# Altium schematic sheet BMS.SchDoc: BMS with Temprature monitor
size A4; SheetNumber: 1; SheetTotal: 1
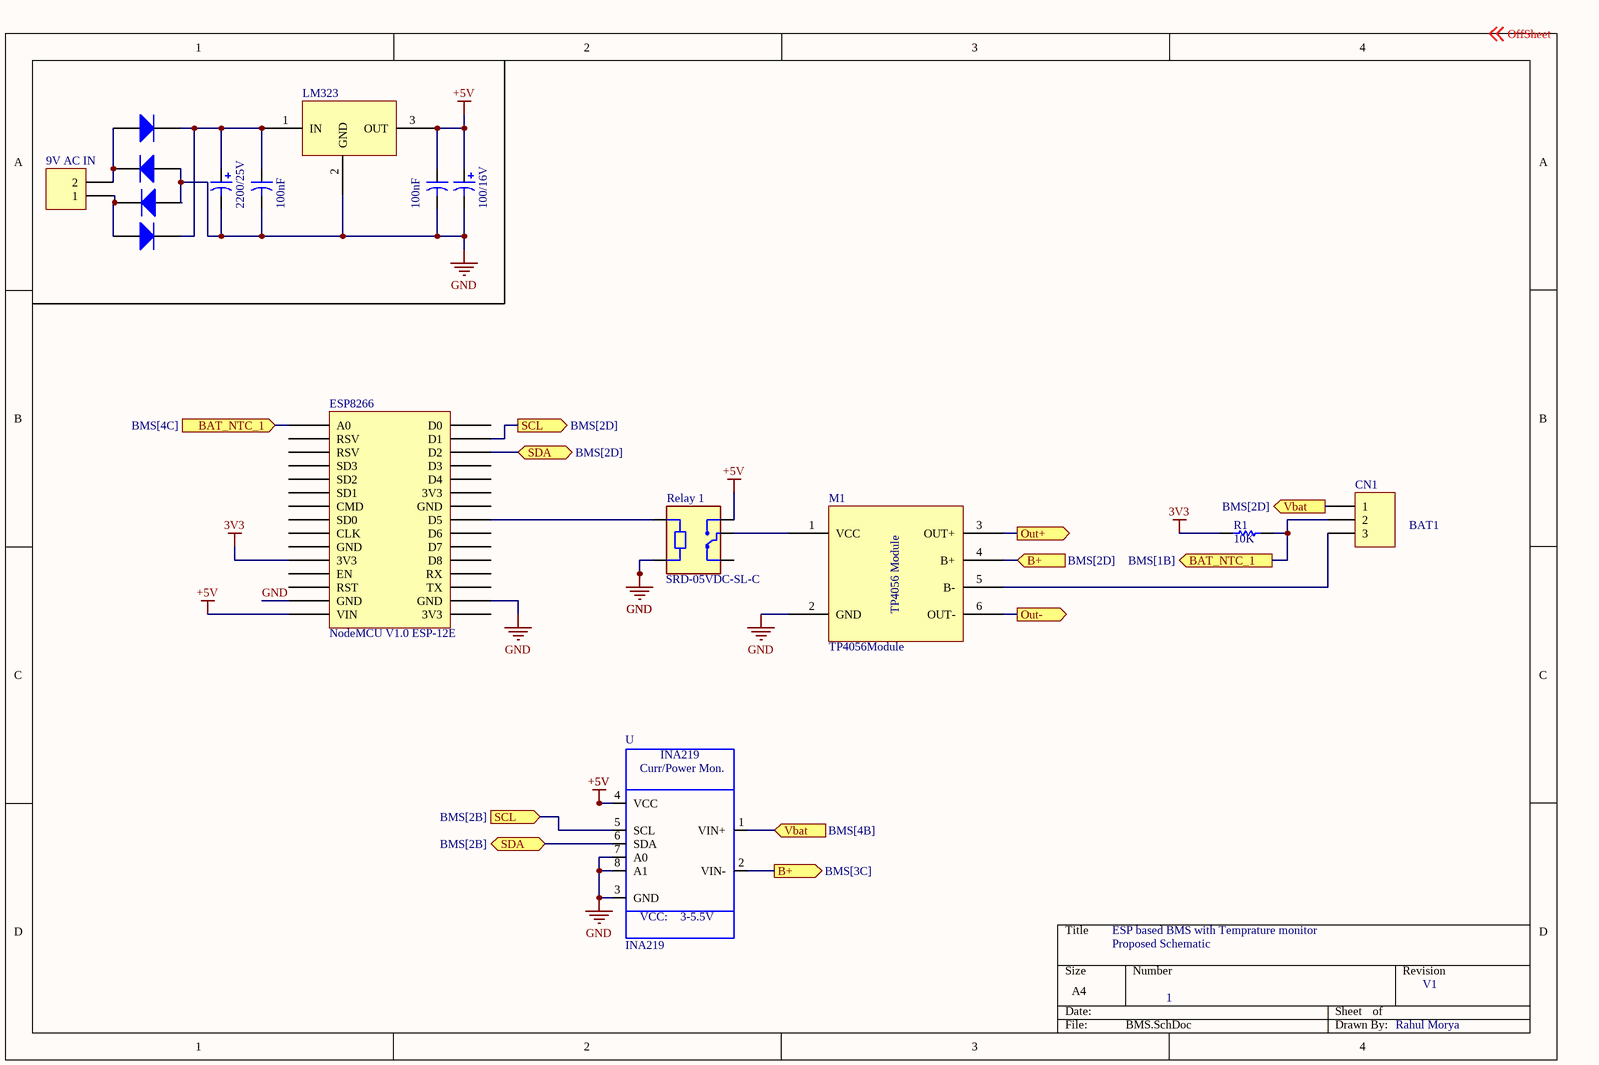
[diagram p0: BMS.SchDoc]

## Parts
(Parts that share a designator on the sheet are numbered #1, #2 ... from top to bottom, then left to right.)
C?#1  value 2200/25V  [RB7.6-15]  (hidden comment: Cap Pol1)
C?#2  value 100nF  [CAPR5-4X5]  (hidden comment: Cap2)
C?#3  value 100nF  [CAPR5-4X5]  (hidden comment: Cap2)
C?#4  value 100/16V  [RB7.6-15]  (hidden comment: Cap Pol1)
CN1  (no value)  [HDR1X3]
CN?  9V AC IN  [HDR1X2]
D?#1  Diode 1N4007  [DO-41]  (value not drawn)
D?#2  Diode 1N4007  [DO-41]  (value not drawn)
D?#3  Diode 1N4007  [DO-41]  (value not drawn)
D?#4  Diode 1N4007  [DO-41]  (value not drawn)
ESP8266  NodeMCU V1.0 ESP-12E  [NodeMCU V1.0 ESP-12E]
LM323  Volt Reg  [PCBComponent_1]  (value not drawn)
M1  TP4056Module  [TP4056Module]
R1  value 10K  (hidden comment: Comment)
Relay_1  SRD-05VDC-SL-C  [RELAY_SRD-05VDC-SL-C]
U  INA219  [SOT23-8]

## Ports
B+ (in, see BMS[2D]), B+ (out, see BMS[3C]), BAT_NTC_1 (in, see BMS[4C]), BAT_NTC_1 (out, see BMS[1B]), Out+ (out), Out- (out), SCL (in, see BMS[2B]), SCL (out, see BMS[2D]), SDA (bidir, see BMS[2B]), SDA (bidir, see BMS[2D]), Vbat (in, see BMS[4B]), Vbat (out, see BMS[2D])

## Nets
3V3: ESP8266.3V3 R1.1
+5V: C?#3.1 C?#4.1 ESP8266.VIN LM323.3(OUT) Relay_1.NO U.4(VCC)
GND: C?#1.2 C?#2.2 C?#3.2 C?#4.2 D?#2.1(A) D?#3.1(A) ESP8266.GND LM323.2(GND) M1.2(GND) Relay_1.A2 U.3(GND) U.7(A0) U.8(A1)
B+: M1.4(B+) U.2(VIN-) ; port B+
BAT_NTC_1: CN1.2 ESP8266.A0 R1.2 ; port BAT_NTC_1
Out+: M1.3(OUT+) ; port Out+
Out-: M1.6(OUT-) ; port Out-
SCL: ESP8266.D1 U.5(SCL) ; port SCL
SDA: ESP8266.D2 U.6(SDA) ; port SDA
Vbat: CN1.1 U.1(VIN+) ; port Vbat
NetC?#1_1: C?#1.1 C?#2.1 D?#1.2(K) D?#4.2(K) LM323.1(IN)
NetCN1_3: CN1.3 M1.5(B-)
NetCN?_1: CN?.1 D?#3.2(K) D?#4.1(A)
NetCN?_2: CN?.2 D?#1.1(A) D?#2.2(K)
NetESP8266_D5: ESP8266.D5 Relay_1.A1
NetM1_1: M1.1(VCC) Relay_1.COM

Not connected (* = marked no-connect by the designer): ESP8266 CLK CMD D0 D3 D4 D6 D7 D8 EN RST RSV RX SD0 SD1 SD2 SD3 TX

## Notes on the sheet
- BAT1
- ESP based BMS with Temprature monitor
- Proposed Schematic
- 1
- V1
- Rahul Morya
- Labels drawn without touching a wire or pin: OffSheet
- (in symbol CMP-017-000000-1) Curr/Power Mon.; VCC:; 3-5.5V
- (in symbol TP4056Module) TP4056 Module

## Library data of the parts
C?#1 C?#4 = Cap Pol1: Polarized Capacitor (Radial); Published: 8-Jun-2000; LatestRevisionDate: 17-Jul-2002; LatestRevisionNote: Re-released for DXP Platform.; PackageReference: RB7.6-15; Publisher: Altium Limited; PackageDescription: Polarized Capacitor (Radial); 2 Leads
C?#2 C?#3 = Cap2: Capacitor; Published: 23-Sep-2002; PackageReference: CAPR5-4X5; Publisher: Altium Limited; PackageDescription: Capacitor; 2 Leads
CN1 = CMP-002-00161-1: Header, 3-Pin; Signal Integrity: Connector; Component Type: Standard; LatestRevisionDate: 17-Jul-2002; Publisher: Altium Limited; Source: Miscellaneous Connectors.SchLib; Pins: 3; Design Item ID: Header 3; LatestRevisionNote: Re-released for DXP Platform.
CN? = Header 2: Header, 2-Pin; LatestRevisionDate: 17-Jul-2002; LatestRevisionNote: Re-released for DXP Platform.; Publisher: Altium Limited
D?#1-D?#4 = Diode 1N4007: 1 Amp General Purpose Rectifier; Published: 8-Jun-2000; LatestRevisionDate: 17-Jul-2002; LatestRevisionNote: Re-released for DXP Platform.; DatasheetVersion: 1998; PackageVersion: Aug-1999; PackageReference: DO-41; Publisher: Altium Limited; PackageDescription: Diode, Axial; Body 5.2 x 2.7 mm (LxDia. max), Lead Dia. 0.86 mm (max); Code_JEDEC: DO-204-AL; ComponentLink1Description: Manufacturer Link; ComponentLink1URL: http://www.fairchildsemi.com/; ComponentLink2Description: Datasheet; ComponentLink2URL: http://www.fairchildsemi.com/ds/1N%2F1N4001.pdf
ESP8266 = CMP-012-000000-1: NodeMCU V1.0 ESP8266 (ESP-12E); Design Item ID: NodeMCU V1.0 ESP-12E; Source: nodemcu.SchLib
M1 = TP4056Module: TP4056 Module for managing battery charging
R1 = Resistor: TC1: 0; SimulationGenericComponent: True; TC2: 0
Relay_1 = SRD-05VDC-SL-C: 5V Trigger Relay Module For Arduino And Raspberry Pi 5V Trigger Relay Module For Arduino And Raspberry Pi; MF: Songle Relay; Check_prices: https://www.snapeda.com/parts/SRD-05VDC-SL-C/Songle+Relay/view-part/?ref=eda; Value: *; Availability: Not in stock; Price: None; Package: NON STANDARD-5 Songle Relay; MP: SRD-05VDC-SL-C; SnapEDA_Link: https://www.snapeda.com/parts/SRD-05VDC-SL-C/Songle+Relay/view-part/?ref=snap
U = CMP-017-000000-1: Current Monitor Regulator High-Side 10mA SOT-23-8; MF: Texas Instruments; Availability: Unavailable; MP: INA219; Price: None; Pin Count: 8; Source: SnapEDAsch.SchLib; Component Type: Standard; SnapEDA_Link: https://www.snapeda.com/parts/INA219/Texas%20Instruments/view-part/564410/?ref=snap; Package: SOT-23-8 Texas Instruments; Design Item ID: INA219; Value: *